# EAGLE design imu (EAGLE 9.6.2)
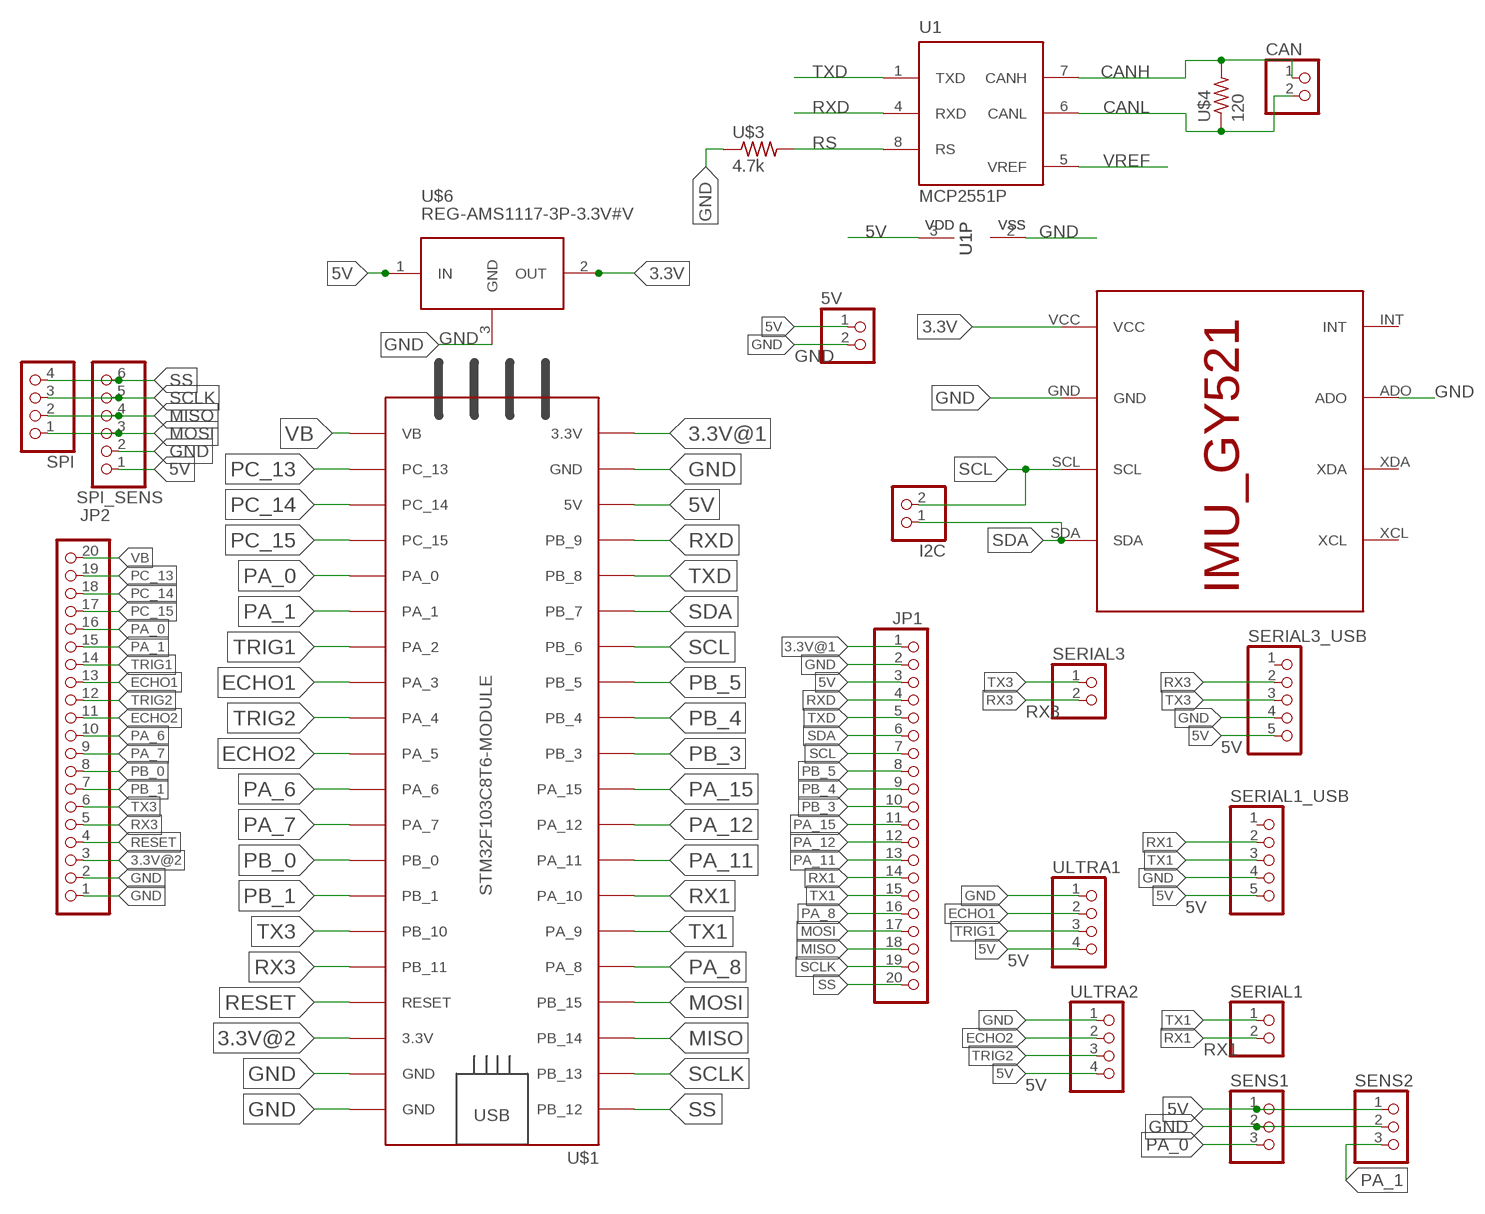
[diagram p0: schematic, sheet 1]

## Parts
5V  PINHD-2_DATA  [1X02_DATA]
CAN  PINHD-2_DATA  [1X02_DATA]
I2C  PINHD-2_DATA  [1X02_DATA]
JP1  PINHD-1X20  [1X20]
JP2  PINHD-1X20  [1X20]
SENS1  PINHD-3_DATA  [1X03_DATA]
SENS2  PINHD-3_DATA  [1X03_DATA]
SERIAL1  PINHD-2_DATA  [1X02_DATA]
SERIAL1_USB  PINHD-5_DATA  [1X05_DATA]
SERIAL3  PINHD-2_DATA  [1X02_DATA]
SERIAL3_USB  PINHD-5_DATA  [1X05_DATA]
SPI  PINHD-4_DATA  [1X04_DATA]
SPI_SENS  PINHD-6_DATA  [1X06_DATA]
U1  MCP2551P  [DIL8]
U$1  STM32F103C8T6-MODULE  [STM32F103C8T6-MODULE]
U$2  IMU_MPU6050  IMU_ROBOCON_GY521  [IMU_GY521]
U$3  4.7k  RES-7  [0204/7]
U$4  120  RES-7  [0204/7]
U$6  REG-AMS1117-3P-3.3V#V  [REG-AMS1117-3P#V]
ULTRA1  PINHD-4_DATA  [1X04_DATA]
ULTRA2  PINHD-4_DATA  [1X04_DATA]

## Nets
3.3V: U$2.VCC U$6.2(OUT)
3.3V@1: JP1.1 U$1.3.3V_1(3.3V)
3.3V@2: JP2.3 U$1.3.3V_2(3.3V)
5V: 5V.1 JP1.3 SENS1.1 SENS2.1 SERIAL1_USB.5 SERIAL3_USB.5 SPI_SENS.1 U1.3(VDD) U$1.5V U$6.1(IN) ULTRA1.4 ULTRA2.4
CANH: CAN.1 U1.7(CANH) U$4.2
CANL: CAN.2 U1.6(CANL) U$4.1
ECHO1: JP2.13 U$1.PA_3 ULTRA1.2
ECHO2: JP2.11 U$1.PA_5 ULTRA2.2
GND: 5V.2 JP1.2 JP2.1 JP2.2 SENS1.2 SENS2.2 SERIAL1_USB.4 SERIAL3_USB.4 SPI_SENS.2 U1.2(VSS) U$1.GND_1(GND) U$1.GND_2(GND) U$1.GND_3(GND) U$2.ADO U$2.GND U$3.1 U$6.3(GND) ULTRA1.1 ULTRA2.1
MISO: JP1.18 SPI.2 SPI_SENS.4 U$1.PB_14
MOSI: JP1.17 SPI.1 SPI_SENS.3 U$1.PB_15
PA_0: JP2.16 SENS1.3 U$1.PA_0
PA_1: JP2.15 SENS2.3 U$1.PA_1
PA_6: JP2.10 U$1.PA_6
PA_7: JP2.9 U$1.PA_7
PA_8: JP1.16 U$1.PA_8
PA_11: JP1.13 U$1.PA_11
PA_12: JP1.12 U$1.PA_12
PA_15: JP1.11 U$1.PA_15
PB_0: JP2.8 U$1.PB_0
PB_1: JP2.7 U$1.PB_1
PB_3: JP1.10 U$1.PB_3
PB_4: JP1.9 U$1.PB_4
PB_5: JP1.8 U$1.PB_5
PC_13: JP2.19 U$1.PC_13
PC_14: JP2.18 U$1.PC_14
PC_15: JP2.17 U$1.PC_15
RESET: JP2.4 U$1.RESET
RS: U1.8(RS) U$3.2
RX1: JP1.14 SERIAL1.2 SERIAL1_USB.2 U$1.PA_10
RX3: JP2.5 SERIAL3.2 SERIAL3_USB.2 U$1.PB_11
RXD: JP1.4 U1.4(RXD) U$1.PB_9
SCL: I2C.2 JP1.7 U$1.PB_6 U$2.SCL
SCLK: JP1.19 SPI.3 SPI_SENS.5 U$1.PB_13
SDA: I2C.1 JP1.6 U$1.PB_7 U$2.SDA
SS: JP1.20 SPI.4 SPI_SENS.6 U$1.PB_12
TRIG1: JP2.14 U$1.PA_2 ULTRA1.3
TRIG2: JP2.12 U$1.PA_4 ULTRA2.3
TX1: JP1.15 SERIAL1.1 SERIAL1_USB.3 U$1.PA_9
TX3: JP2.6 SERIAL3.1 SERIAL3_USB.3 U$1.PB_10
TXD: JP1.5 U1.1(TXD) U$1.PB_8
VB: JP2.20 U$1.VB
VREF: U1.5(VREF)
Unconnected: SERIAL1_USB.1 SERIAL3_USB.1 U$2.INT U$2.XCL U$2.XDA

## Library data of the parts
5V CAN I2C SERIAL1 SERIAL3 = MIA_LIBRARY-2-2-2:PINHD-2_DATA: PIN HEADER
JP1 JP2 = MIA_LIBRARY-2-2-2:PINHD-1X20: PIN HEADER
SENS1 SENS2 = MIA_LIBRARY-2-2-2:PINHD-3_DATA: PIN HEADER
SERIAL1_USB SERIAL3_USB = MIA_LIBRARY-2-2-2:PINHD-5_DATA: PIN HEADER
SPI ULTRA1 ULTRA2 = MIA_LIBRARY-2-2-2:PINHD-4_DATA: PIN HEADER
SPI_SENS = MIA_LIBRARY-2-2-2:PINHD-6_DATA: PIN HEADER
U1 = MIA_LIBRARY-2-2-2:MCP2551: High Speed CAN tranceiver
U$1 = MIA_LIBRARY-2-2-2:STM32F103C8T6-MODULE: STM32F103C8T6 module with ARM Cortex-3, 20kB SRAM, 64kB Flash, 72MHz
U$2 = MIA_LIBRARY-2-2-2:IMU_ROBOCON_GY521
U$3 U$4 = MIA_LIBRARY-2-2-2:RES-7
U$6 = MIA_LIBRARY-2-2-2:REG-AMS1117-3P-*: Linear Regulator based on AMS1117 chip 3-pin version AMS1117 datasheet is available here: http://www.advanced-monolithic.com/pdf/ds1117.pdf Click here to find device on ebay.com <http://www.ebay.com/sch/ams1117+module> Note: There are many variants. Search for the proper version.

## Board
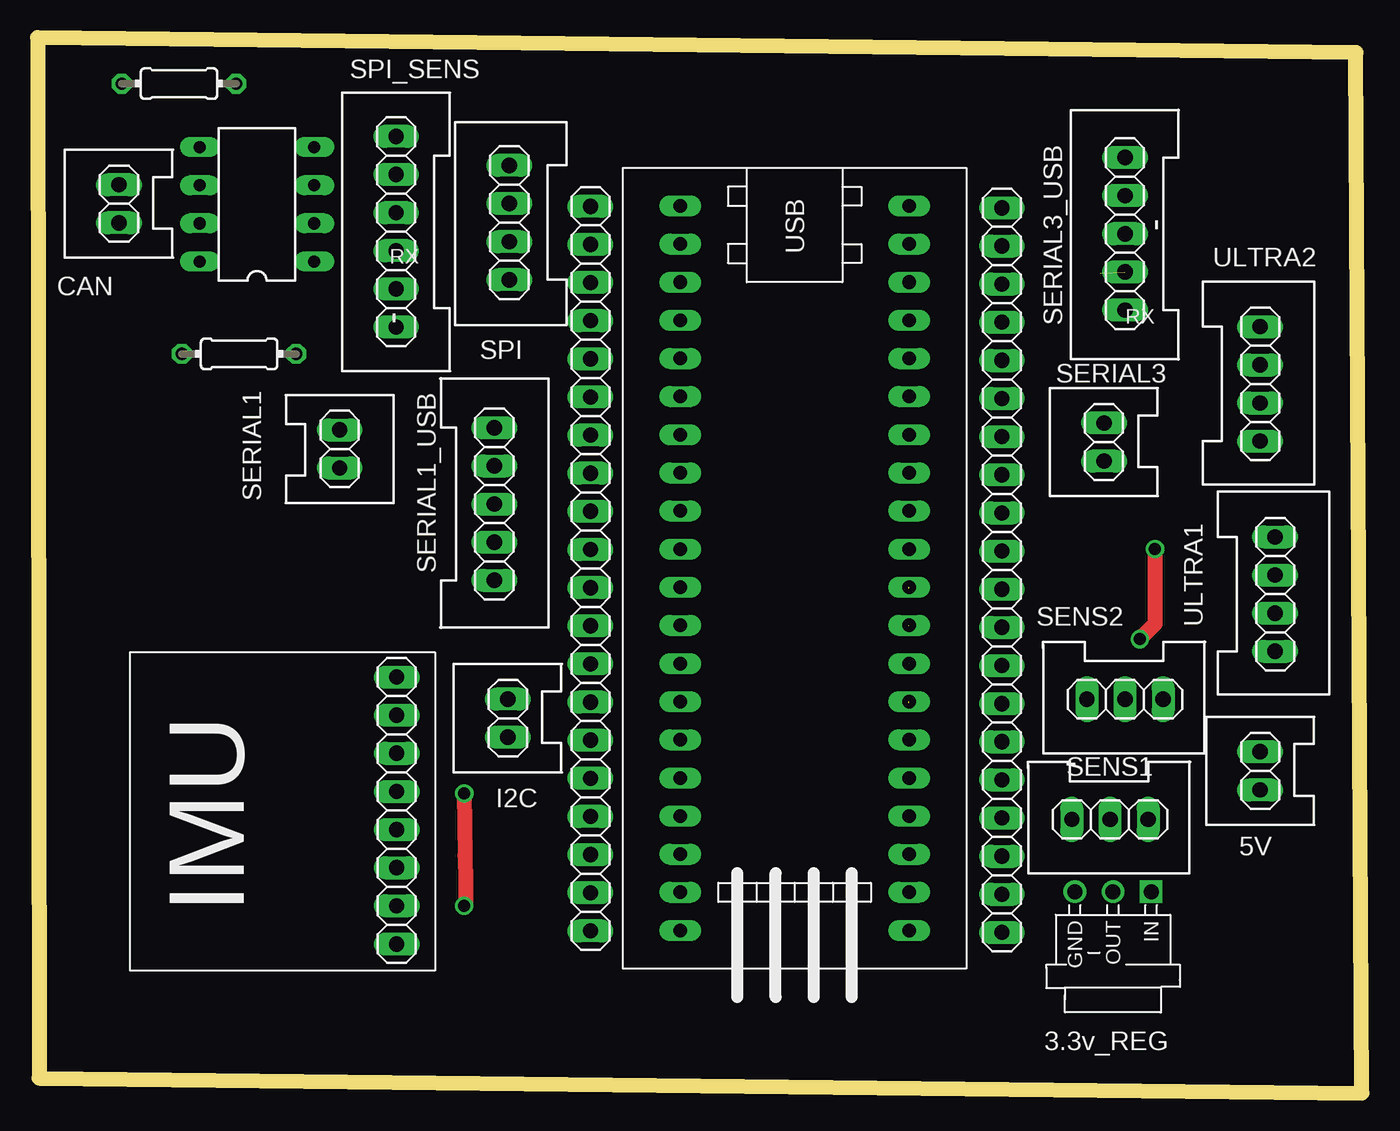
[diagram p1: board, top side]
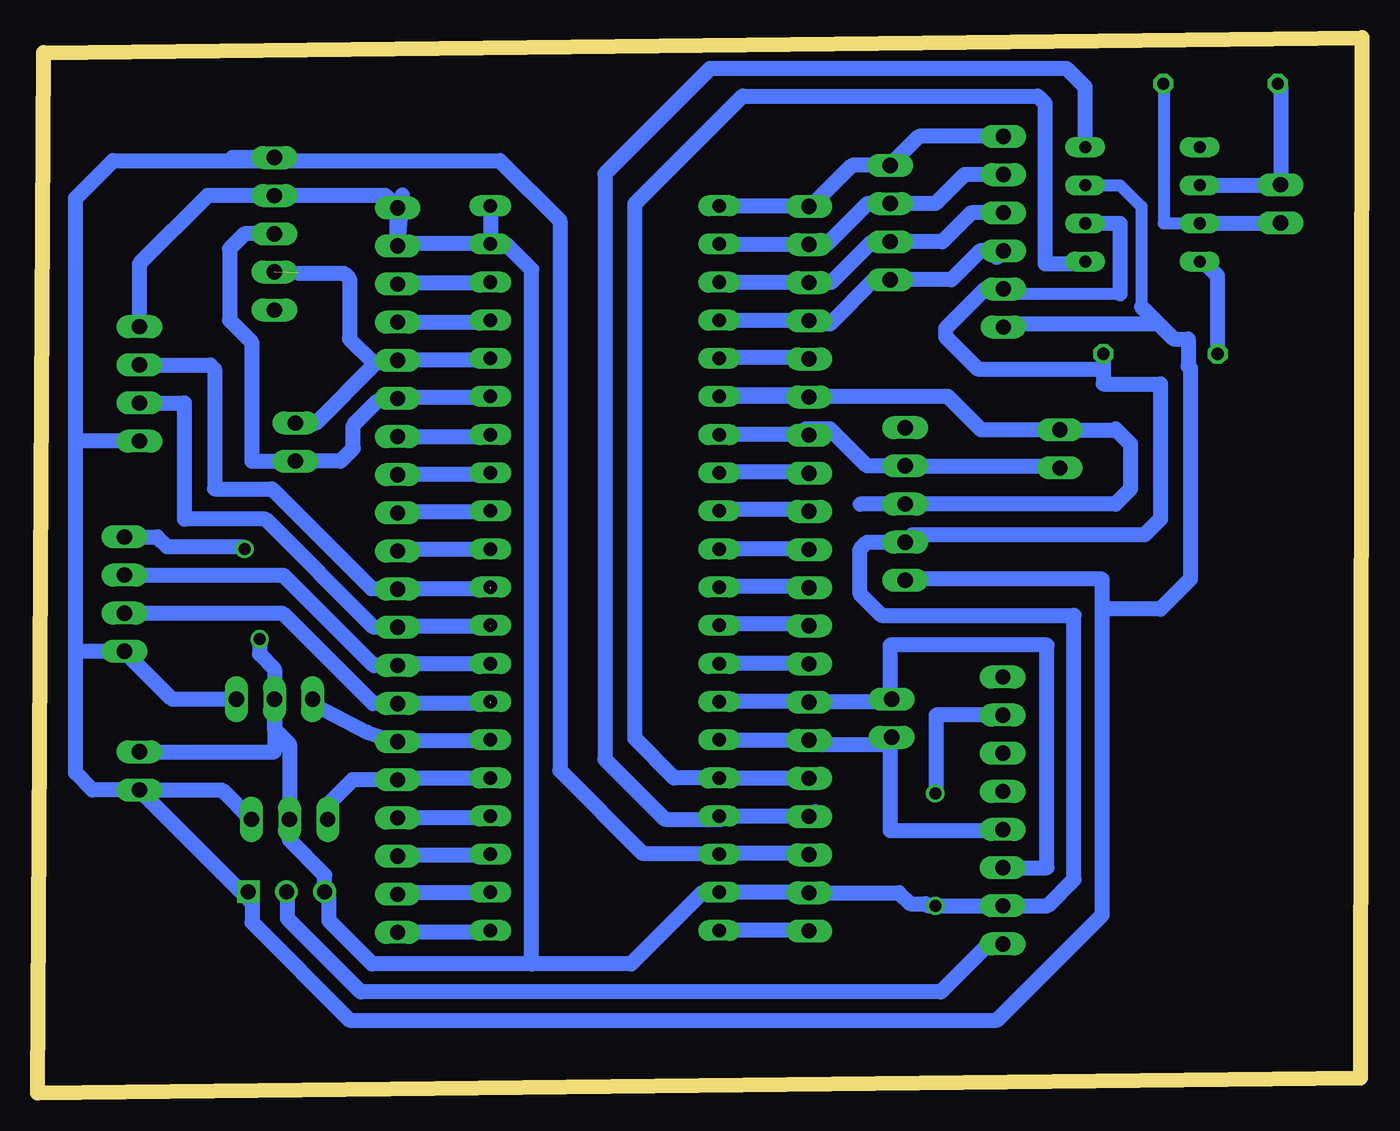
[diagram p2: board, bottom side, seen from below]

Size 88.2 x 70.31 mm. Coordinates in mm from the lower left corner, seen from the top.
Outline: 0.11,1 88.2,0 87.8,69.31 0,70.31 0.11,1
Copper layers (1*16): Top 0.035mm / dielectric 1.5mm / Bottom 0.035mm
Design rules "default *": minimum track width 1mm, minimum drill 0.35mm, track to track 0.8mm, track to pad 0.8mm, pad to pad 0.8mm, via to via 0.8mm, smd to smd 6mil, copper to edge 0.8mm, drill to drill 0.8mm, minimum pad ring 10mil, minimum via ring 8mil, stop-mask expansion 4mil, vias tented up to drill 0mil, thermal gap 10mil

### Footprints (pad centres in the part's own frame; a part is rotated, then mirrored left to right if it is on the bottom)
1X02_DATA = drill 1.016 long: 1 -1.27,0; 2 1.27,0
1X20 = drill 1.016 long: 1 -24.13,0; 2 -21.59,0; 3 -19.05,0; 4 -16.51,0; 5 -13.97,0; 6 -11.43,0; 7 -8.89,0; 8 -6.35,0; 9 -3.81,0; 10 -1.27,0; 11 1.27,0; 12 3.81,0; 13 6.35,0; 14 8.89,0; 15 11.43,0; 16 13.97,0; 17 16.51,0; 18 19.05,0; 19 21.59,0; 20 24.13,0
1X03_DATA = drill 1.016 long: 1 -2.54,0; 2 0,0; 3 2.54,0
1X05_DATA = drill 1.016 long: 1 -5.08,0; 2 -2.54,0; 3 0,0; 4 2.54,0; 5 5.08,0
1X04_DATA = drill 1.016 long: 1 -3.81,0; 2 -1.27,0; 3 1.27,0; 4 3.81,0
1X06_DATA = drill 1.016 long: 1 -6.35,0; 2 -3.81,0; 3 -1.27,0; 4 1.27,0; 5 3.81,0; 6 6.35,0
DIL8 = drill 0.813 long: 1 -3.81,-3.81; 2 -1.27,-3.81; 3 1.27,-3.81; 4 3.81,-3.81; 5 3.81,3.81; 6 1.27,3.81; 7 -1.27,3.81; 8 -3.81,3.81
STM32F103C8T6-MODULE = drill 0.9 long: 3.3V_1 25.4,-7.62; 3.3V_2 -17.78,7.62; 5V 20.32,-7.62; GND_1 22.86,-7.62; GND_2 -20.32,7.62; GND_3 -22.86,7.62; PA_0 15.24,7.62; PA_1 12.7,7.62; PA_2 10.16,7.62; PA_3 7.62,7.62; PA_4 5.08,7.62; PA_5 2.54,7.62; PA_6 0,7.62; PA_7 -2.54,7.62; PA_8 -12.7,-7.62; PA_9 -10.16,-7.62; PA_10 -7.62,-7.62; PA_11 -5.08,-7.62; PA_12 -2.54,-7.62; PA_15 0,-7.62; PB_0 -5.08,7.62; PB_1 -7.62,7.62; PB_3 2.54,-7.62; PB_4 5.08,-7.62; PB_5 7.62,-7.62; PB_6 10.16,-7.62; PB_7 12.7,-7.62; PB_8 15.24,-7.62; PB_9 17.78,-7.62; PB_10 -10.16,7.62; PB_11 -12.7,7.62; PB_12 -22.86,-7.62; PB_13 -20.32,-7.62; PB_14 -17.78,-7.62; PB_15 -15.24,-7.62; PC_13 22.86,7.62; PC_14 20.32,7.62; PC_15 17.78,7.62; RESET -15.24,7.62; VB 25.4,7.62
IMU_GY521 = drill 1.016 long: ADO -6.35,0; GND 6.35,0; INT -8.89,0; SCL 3.81,0; SDA 1.27,0; VCC 8.89,0; XCL -3.81,0; XDA -1.27,0
0204/7 = drill 0.813 octagon: 1 -3.81,0; 2 3.81,0
REG-AMS1117-3P#V = drill 1 square: 1 -2.54,-5.08 | drill 1: 2 0,-5.08; 3 2.54,-5.08

### Placement (x,y rotation side)
5V  81.42,21.47 90 top
CAN  5.42,59.24 90 top
I2C  31.32,24.98 90 top
JP1  36.82,34.94 90 top
JP2  64.22,34.84 270 top
SENS1  71.42,18.24 180 top
SENS2  72.42,26.24 180 top
SERIAL1  20.12,42.91 270 top
SERIAL1_USB  30.42,39.24 270 top
SERIAL3  71.02,43.37 90 top
SERIAL3_USB  72.42,57.24 90 top
SPI  31.42,57.99 90 top
SPI_SENS  23.88,57.38 90 top
U1  14.62,59.21 90 top
U$1  50.42,36.24 270 top
U$2  23.92,18.83 270 top
U$3  13.42,49.24 180 top
U$4  9.42,67.24 0 top
U$6  71.62,8.34 180 top
ULTRA1  82.42,33.24 270 top
ULTRA2  81.42,47.24 270 top

### Tracks (layer width: path | path; a pad name or v marks a point on that pad's centre or on a via)
3.3V
  Bottom 1: U$2.VCC 24.84,9.94 28.05,6.74 66.67,6.74 71.55,11.62 71.55,13.37 U$6.2
3.3V@1
  Bottom 1: U$1.3.3V_1 42.8,10.87 36.92,10.87 JP1.1
3.3V@2
  Bottom 1: U$1.3.3V_2 58.05,53.99 64.17,53.99 JP2.3
5V
  Bottom 0.813: U1.3 16.11,60.47 14.69,59.06 14.69,52.39
  Bottom 1: JP1.3 36.92,15.99 42.8,15.99 U$1.5V 43.3,15.99 47.92,15.99 53.42,21.49 53.42,58.12 57.42,62.12 75.42,62.12 | 5V.1 74.05,12.83 74.05,13.49 U$6.1 73.92,12.99 73.92,11.37 67.42,4.87 24.3,4.87 17.3,11.87 17.3,32.24 | 85.67,29.24 85.67,21.32 84.55,20.2 5V.1 | 85.67,29.24 85.67,43.24 | 85.67,43.24 85.67,59.62 83.17,62.12 75.42,62.12 | 17.3,32.24 17.3,34.24 31.42,34.24 31.34,34.16 SERIAL1_USB.5 | 5V.1 75.92,20.2 SENS1.1 | ULTRA2.4 85.48,43.43 85.67,43.24 | SENS2.1 79.23,26.24 ULTRA1.4 85.48,29.43 85.67,29.24 | 13.57,51.27 23.63,51.27 SPI_SENS.1 | SERIAL3_USB.5 75.22,62.32 75.42,62.12 | 13.57,51.27 14.69,52.39 | 13.57,51.27 12.54,50.24 11.57,50.24 11.57,48.43 11.42,48.28 11.42,34.24 13.42,32.24 17.3,32.24
CANH
  Bottom 0.813: U1.7 13.2,57.93 13.2,67.21 U$4.2
  Bottom 1: CAN.1 5.46,57.93 U1.7
CANL
  Bottom 1: U$4.1 5.42,67.05 CAN.2 5.42,60.47 U1.6
ECHO1  (1 unrouted)
  Bottom 1: U$1.PA_3 64.05,28.62 64.17,28.49 JP2.13 65.81,28.49 71.83,34.51 ULTRA1.2
ECHO2  (1 unrouted)
  Bottom 1: 64.17,33.62 58.05,33.62 | 64.17,33.62 JP2.11 | ULTRA2.2 76.69,48.51 76.42,48.24 76.42,40.24 72.58,40.24 65.95,33.62 64.17,33.62
GND  (via drill 0.8)
  Top 1: v74.42,36.24 74.42,31.24 v73.42,30.24 | v28.42,19.98 28.46,15.81 28.52,14.03 28.52,12.58 v28.41,12.48
  Bottom 0.813: SPI_SENS.2 23.56,53.25 16.11,53.25
  Bottom 1: U$1.GND_2 58.05,56.62 58.05,58.99 U$1.GND_3 | JP2.2 64.3,56.49 64.3,58.87 JP2.1 65.03,59.78 SERIAL3_USB.4 76.88,59.78 81.42,55.24 ULTRA2.1 | 63.92,59.85 JP2.2 | U$1.GND_2 58.55,56.62 63.8,56.62 JP2.2 | 5V.2 72.42,22.74 SENS2.2 | 69.05,13.49 U$6.3 | 55.3,8.62 48.67,8.62 43.92,13.37 43.3,13.37 U$1.GND_1 42.8,13.37 36.92,13.37 JP1.2 30.82,13.35 30.09,12.62 29.05,12.62 28.92,12.48 v28.41,12.48 U$2.GND 20.92,12.48 19.17,14.23 19.17,31.83 32.01,31.83 33.42,33.24 33.42,36.24 32.96,36.7 SERIAL1_USB.4 29.94,37.18 14.48,37.18 13.42,38.24 13.42,47.24 17.23,47.24 17.23,48.24 | 55.3,8.62 65.92,8.62 68.8,11.49 68.8,12.99 U$6.3 | 55.3,8.62 55.3,54.87 56.92,56.49 57.55,56.49 U$1.GND_2 | U$6.3 69.08,14.53 71.42,16.87 SENS1.2 71.42,23.24 72.42,24.24 SENS2.2 | U1.2 16.11,57.93 16.11,53.25 | U$3.1 17.23,48.24 | 17.23,48.24 25.59,48.24 27.73,50.38 27.73,50.94 25.09,53.57 SPI_SENS.2 | ULTRA1.1 80.23,37.05 79.58,36.4 74.58,36.4 v74.42,36.24 | v73.42,30.24 73.42,29.24 72.42,28.24 SENS2.2 | U$2.ADO 28.36,25.18 28.36,20.04 v28.42,19.98
MISO
  Bottom 1: 24.01,58.51 SPI_SENS.4 26.02,58.65 27.95,56.72 SPI.2 32.63,56.72 35.35,53.99 JP1.18 42.77,53.99 | 42.77,53.99 43.17,53.99 43.42,54.24 | U$1.PB_14 42.77,53.99
MOSI
  Bottom 1: 24.33,55.66 SPI_SENS.3 25.41,56.11 27.34,54.18 SPI.1 32.49,54.18 35.42,51.24 36.61,51.24 JP1.17 42.77,51.45 U$1.PB_15
PA_0
  Bottom 1: U$1.PA_0 64.17,20.99 JP2.16 67.22,20.87 68.88,19.21 SENS1.3
PA_1
  Bottom 1: U$1.PA_1 58.05,23.49 64.17,23.49 JP2.15 66.25,24.04 69.88,25.93 SENS2.3
PA_6
  Bottom 1: U$1.PA_6 64.05,36.24 64.17,36.12 JP2.10
PA_7
  Bottom 1: U$1.PA_7 58.05,38.74 64.17,38.74 JP2.9
PA_8
  Bottom 1: U$1.PA_8 42.8,48.99 36.92,48.99 JP1.16
PA_11
  Bottom 1: U$1.PA_11 42.8,41.37 36.92,41.37 JP1.13
PA_12
  Bottom 1: U$1.PA_12 42.8,38.87 36.92,38.87 JP1.12
PA_15
  Bottom 1: U$1.PA_15 36.92,36.24 JP1.11
PB_0
  Bottom 1: U$1.PB_0 58.05,41.24 64.17,41.24 JP2.8
PB_1
  Bottom 1: U$1.PB_1 58.05,43.74 64.17,43.74 JP2.7
PB_3
  Bottom 1: U$1.PB_3 42.8,33.74 36.92,33.74 JP1.10
PB_4
  Bottom 1: U$1.PB_4 42.8,31.24 36.92,31.24 JP1.9
PB_5
  Bottom 1: U$1.PB_5 36.92,28.62 JP1.8
PC_13
  Bottom 1: U$1.PC_13 58.05,13.37 64.17,13.37 JP2.19
PC_14
  Bottom 1: U$1.PC_14 58.05,15.87 64.17,15.87 JP2.18
PC_15
  Bottom 1: U$1.PC_15 58.05,18.37 64.17,18.37 JP2.17
RESET
  Bottom 1: U$1.RESET 58.05,51.37 64.17,51.37 JP2.4
RS
  Bottom 1: U$3.2 9.61,54.43 10.57,55.39 U1.8
RX1
  Bottom 1: 37.42,43.87 36.92,43.87 JP1.14 36.41,44.24 | 37.42,43.87 U$1.PA_10 43.3,43.99 | SERIAL1.2 20.26,41.78 SERIAL1_USB.2 32.96,41.78 35.42,44.24 37.05,44.24 37.42,43.87
RX3  (1 unrouted)
  Bottom 1: U$1.PB_11 58.05,48.87 64.17,48.87 JP2.5 64.67,48.62 65.67,48.62 | SERIAL3.2 69.64,44.64 65.67,48.62 | 70.8,54.62 67.8,54.62 67.42,54.24 67.42,50.24 65.8,48.62 65.67,48.62
RXD
  Bottom 1: 36.92,18.49 JP1.4 | 36.42,18.74 JP1.4 | JP1.4 42.42,18.43 | 42.42,18.43 42.77,18.43 U$1.PB_9 | U1.4 18.43,67.01 19.65,68.24 43.42,68.24 50.42,61.24 50.42,22.24 46.42,18.24 42.61,18.24 42.42,18.43
SCL
  Bottom 1: 36.92,26.12 JP1.7 | JP1.7 36.85,26.08 U$1.PB_6 | U$2.SCL 20.97,15.02 20.97,29.85 31.42,29.85 31.42,26.15 | JP1.7 31.42,26.05 31.42,26.15 | I2C.2 31.42,26.15
SCLK
  Bottom 1: 24.15,60.92 SPI_SENS.5 26.48,61.19 28.41,59.26 SPI.3 32.92,59.26 35.65,56.53 JP1.19 42.77,56.53 U$1.PB_13
SDA
  Bottom 1: U$2.SDA 23.99,17.49 31.42,17.49 31.42,23.24 | 36.92,23.62 JP1.6 | JP1.6 42.77,23.51 U$1.PB_7 | JP1.6 36.55,23.24 31.42,23.24 | I2C.1 31.42,23.61 31.42,23.24
SS
  Bottom 1: SPI_SENS.6 29.49,63.73 SPI.4 33.96,61.8 36.69,59.07 JP1.20 42.77,59.07 U$1.PB_12
TRIG1  (1 unrouted)
  Bottom 1: 58.05,25.99 64.17,25.99 JP2.14 65.86,25.95 71.88,31.97 ULTRA1.3
TRIG2  (1 unrouted)
  Bottom 1: 58.05,31.12 64.17,31.12 JP2.12 65.81,31.03 73.02,38.24 78.42,38.24 78.42,45.97 ULTRA2.3
TX1
  Bottom 1: 36.42,46.62 JP1.15 36.92,46.49 42.8,46.49 U$1.PA_9 27.58,46.4 25.36,44.18 SERIAL1.1 16.48,44.18 16.42,44.24 15.42,43.24 15.42,40.24 16.42,39.24 SERIAL1_USB.3 | 31.42,39.24 SERIAL1_USB.3 | SERIAL1_USB.3 33.42,39.24
TX3
  Bottom 1: U$1.PB_10 58.05,46.37 64.17,46.37 JP2.6 64.67,46.12 65.55,46.12 67.17,44.49 67.17,42.95 68.02,42.1 SERIAL3.1 73.92,42.1 73.92,49.99 75.42,51.49 75.42,56.24 74.42,57.24 SERIAL3_USB.3
TXD
  Bottom 1: 36.92,20.99 JP1.5 42.77,20.97 U$1.PB_8 45.8,21 48.42,23.62 48.42,59.24 41.25,66.41 21.59,66.41 21.1,65.93 21.1,55.24 18.58,55.24 U1.1
VB
  Bottom 1: U$1.VB 58.05,10.74 64.17,10.74 JP2.20

### Text on the board
tPlace: 3.3v_REG
tNames: - | RX | - | RX | -